# Altium schematic sheet PWR_INP.SchDoc
size A3; SheetNumber: 10; SheetTotal: 13
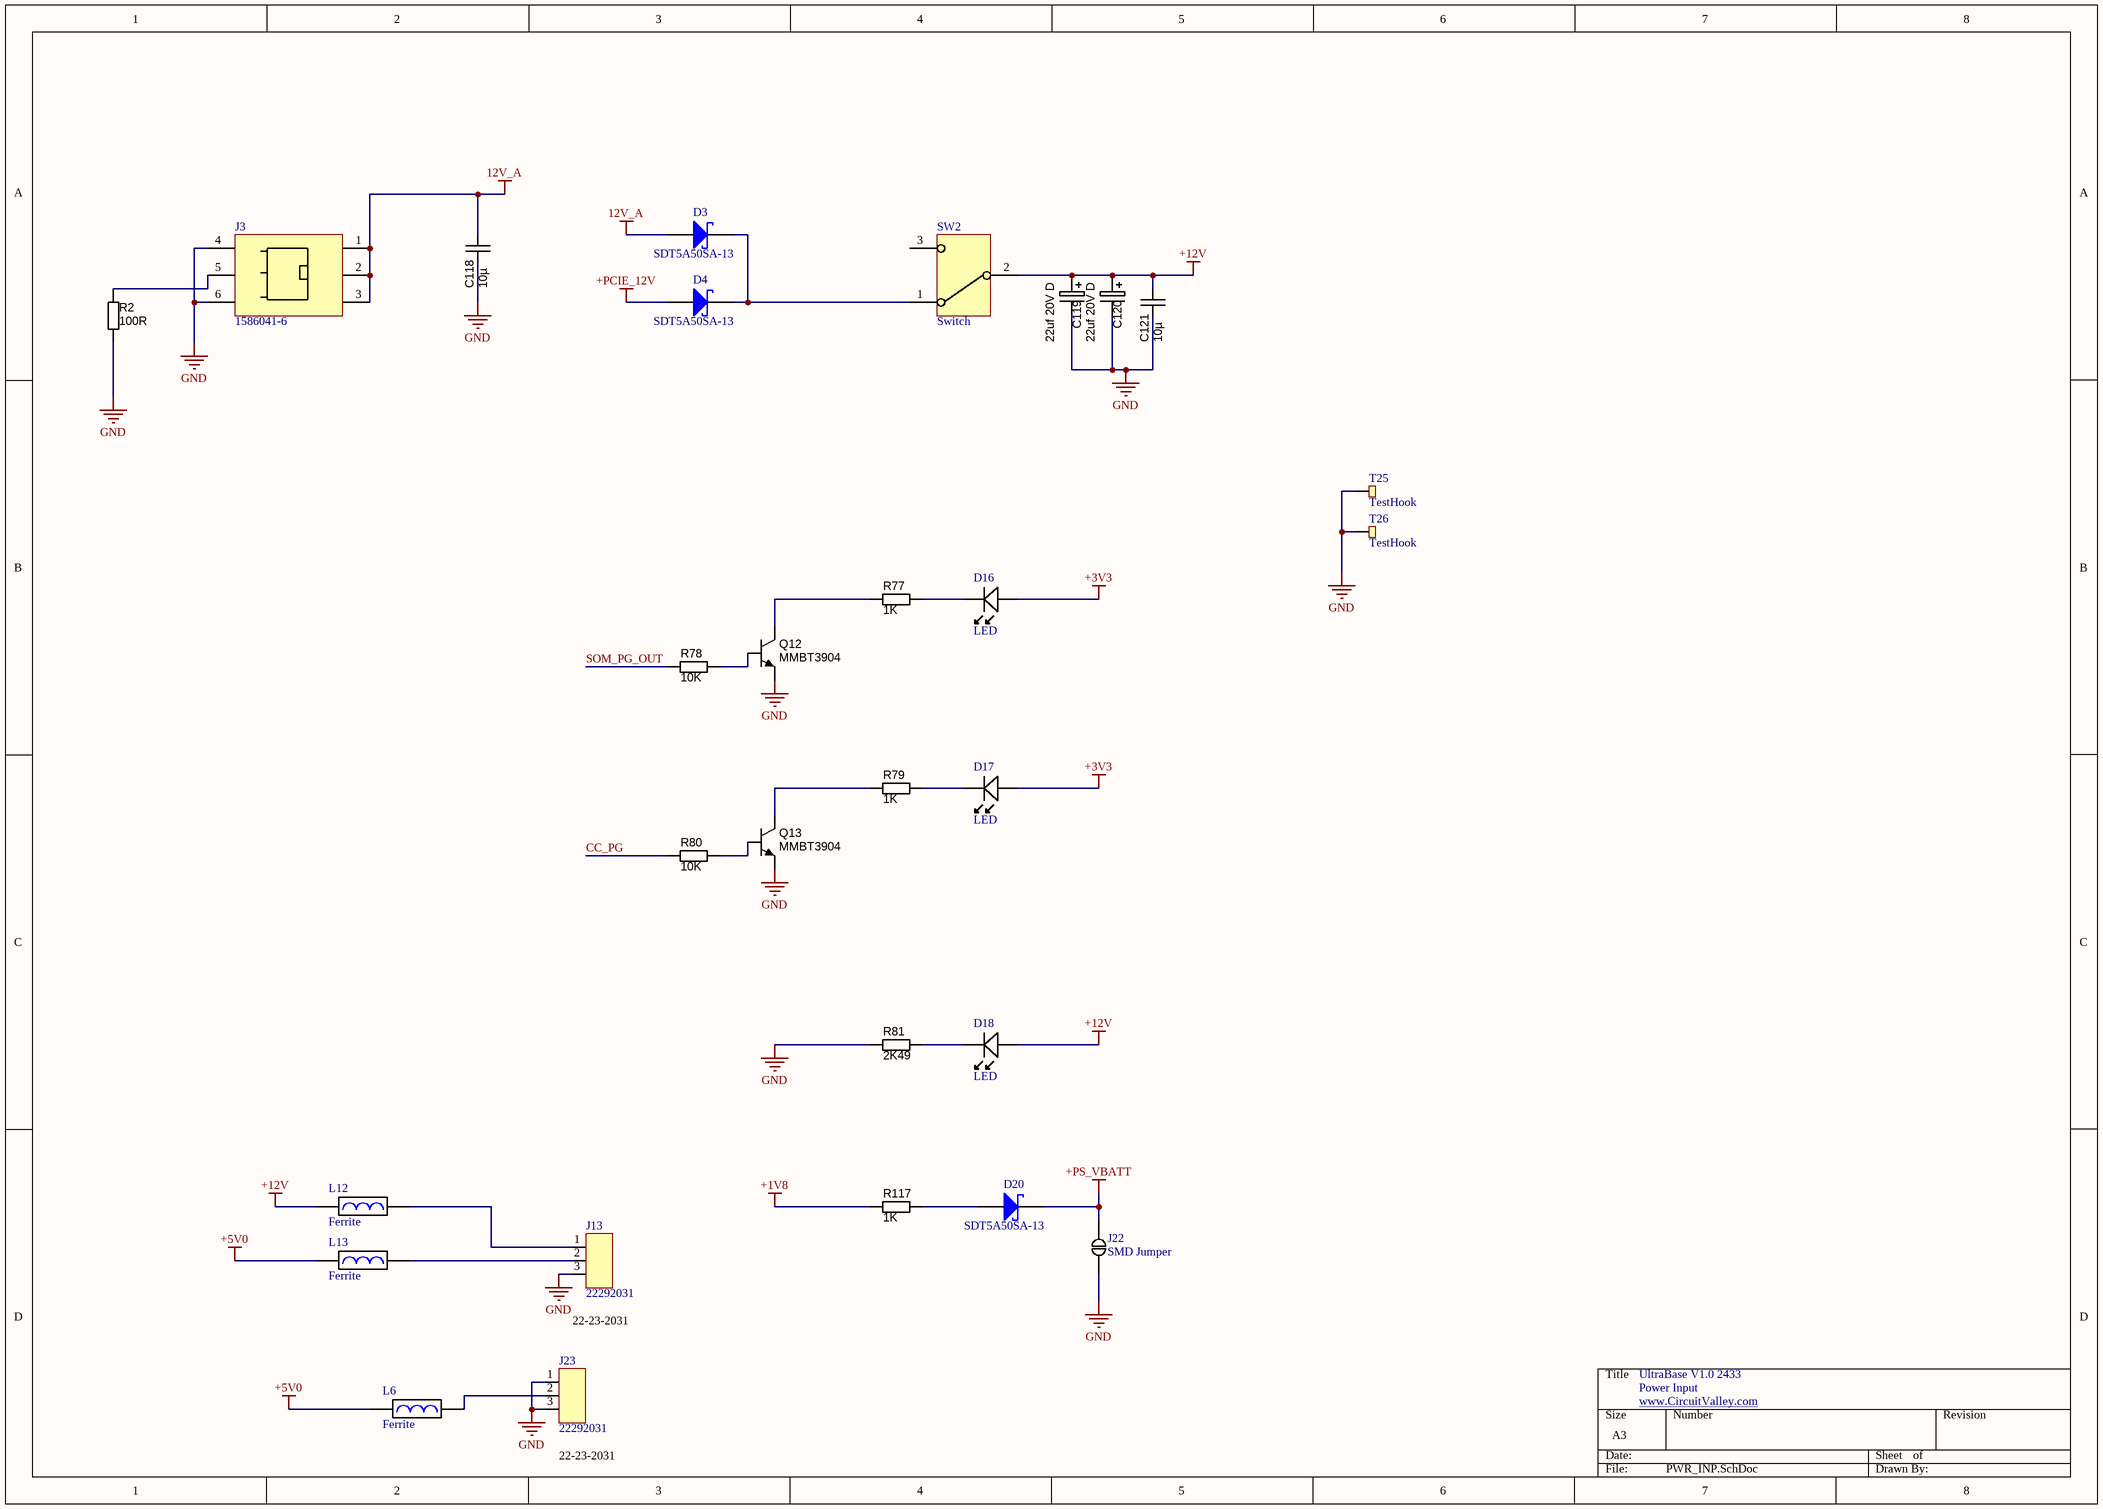
[diagram p0: PWR_INP.SchDoc]

## Parts
C118  10µ  [CAPC3225N]
C119  value 22uf 20V D  [CAPMP7343X310N]  (hidden comment: 47uf 20V D)
C120  value 22uf 20V D  [CAPMP7343X310N]  (hidden comment: 47uf 20V D)
C121  10µ  [CAPC3225N]
D3  SDT5A50SA-13  [DO-214AC]
D4  SDT5A50SA-13  [DO-214AC]
D16  LED  [1206_LED]
D17  LED  [1206_LED]
D18  LED  [1206_LED]
D20  SDT5A50SA-13  [DO-214AC]
J3  1586041-6  [1586043-6]
J13  22292031  [22-23-2031]
J22  SMD Jumper  [SMD_Jumper]  (net tie, no BOM)
J23  22292031  [22-23-2031]
L6  Ferrite  [FBC2012N]
L12  Ferrite  [FBC2012N]
L13  Ferrite  [FBC2012N]
Q12  Manufacturer Part Number 1: MMBT3904  [SOT23-3]  (hidden comment: NPN_MMBT3904)
Q13  Manufacturer Part Number 1: MMBT3904  [SOT23-3]  (hidden comment: NPN_MMBT3904)
R2  value 100R  [RESC1608N]  (hidden comment: RES_NL_0603)
R77  value 1K  [RESC1608N]  (hidden comment: RES_NL_0603)
R78  value 10K  [RESC1608N]  (hidden comment: RES_NL_0603)
R79  value 1K  [RESC1608N]  (hidden comment: RES_NL_0603)
R80  value 10K  [RESC1608N]  (hidden comment: RES_NL_0603)
R81  value 2K49  [RESC1608N]  (hidden comment: RES_NL_0603)
R117  value 1K  [RESC1608N]  (hidden comment: RES_NL_0603)
SW2  Switch  [1MS1T1B4M7QES]
T25  TestHook  [1502-x]
T26  TestHook  [1502-x]

## Nets
12V_A: C118.1 D3.1(A) J3.1(IN) J3.2(IN) J3.3(IN)
+1V8: R117.1
+3V3: D16.A D17.A
+5V0: L6.1 L13.1
+12V: C119.1 C120.1 C121.1 D18.A L12.1 SW2.2
+PCIE_12V: D4.1(A)
+PS_VBATT: D20.2(K) J22.2
GND: C118.2 C119.2 C120.2 C121.2 J3.4(IN) J3.6 J13.3 J22.1 J23.1 J23.3 Q12.2(E) Q13.2(E) R2.2 R81.1 T25.1(TP) T26.1(TP)
CC_PG: R80.1
SOM_PG_OUT: R78.1
NetD3_2: D3.2(K) D4.2(K) SW2.1
NetD16_K: D16.K R77.2
NetD17_K: D17.K R79.2
NetD18_K: D18.K R81.2
NetD20_1: D20.1(A) R117.2
NetJ3_5: J3.5 R2.1
NetJ13_1: J13.1 L12.2
NetJ13_2: J13.2 L13.2
NetJ23_2: J23.2 L6.2
NetQ12_1: Q12.1(B) R78.2
NetQ12_3: Q12.3(C) R77.1
NetQ13_1: Q13.1(B) R80.2
NetQ13_3: Q13.3(C) R79.1

Not connected (* = marked no-connect by the designer): SW2 3

## Notes on the sheet
- 22-23-2031
- UltraBase V1.0 2433
- Power Input
- (near J23) 22-23-2031
- www.CircuitValley.com <http://www.CircuitValley.com>

## Library data of the parts
C118 C121 = CAPC_10u_1210_50V: Capacitor SMD Cer 10uF 20% 16V X5R 1210; Manufacturer 1: Taiyo Yuden; Manufacturer Part Number 1: UMK325BJ106MM-T; Ratings: 50V; X5R; Material: ceramic; Package / Case: 1210 (3225 Metric); Tolerance: ±20%; Size / Dimension: 0.126" L x 0.098" W (3.20mm x 2.50mm); Supplier 1: Digi-Key; Supplier Part Number 1: 587-2225-1-ND; Value: 10µ
C119 C120 = CAPT_330u_2917_6V3: Capacitor SMD Tant 330uF 20% 6V3 2917; Manufacturer Part Number: T520D337M006ATE015; Part: TCJY226M025R0070; Ratings: 6.3V; Material: Solid Tantalum; ESR (Equivalent Series Resistance): 15 mOhm; Package / Case: 2917 (7343 Metric); Tolerance: ±20%; Operating Temperature: -55°C ~ 125°C; Size / Dimension: 0.287" L x 0.169" W (7.30mm x 4.30mm); Height - Seated (Max): 0.122" (3.10mm); Manufacturer Size Code: D; Supplier 1: Digi-Key; Supplier Part Number 1: 399-4052-1-ND; ComponentLink1URL: http://www.kemet.com/datasheets&T520D337M006ATE015; ComponentLink1Description: T520D Datasheet
D3 D4 D20 = Diode
J3 = 1586041-6: PCIE Molex Power
J22 = SMD_Jumper
L6 L12 L13 = Ferrite Bead
Q12 Q13 = NPN_MMBT3904: Transistor SMD NPN 40V 0.2A 350mW SOT-23; Manufacturer 1: Fairchild Semiconductor; Ratings: 40V; 200mA; 350mW; Material: Si; Package / Case: SOT-23; Supplier 1: Digi-Key; Supplier Part Number 1: MMBT3904FSCT-ND; Transistor Type: NPN; Mounting Type: Surface Mount
R2 R77-R81 R117 = RES_NL_0603: Resistor, SMD chip; Manufacturer 1: Royal Ohm; Ratings: 1/10 W; Tolerance: ±5%; Package / Case: 0603 (1608 metric)
SW2 = Switch_SPDT: Switch SPDT